# Altium schematic sheet Multiboard_Analog_Connector.SchDoc
size A3; SheetNumber: 1; SheetTotal: 4
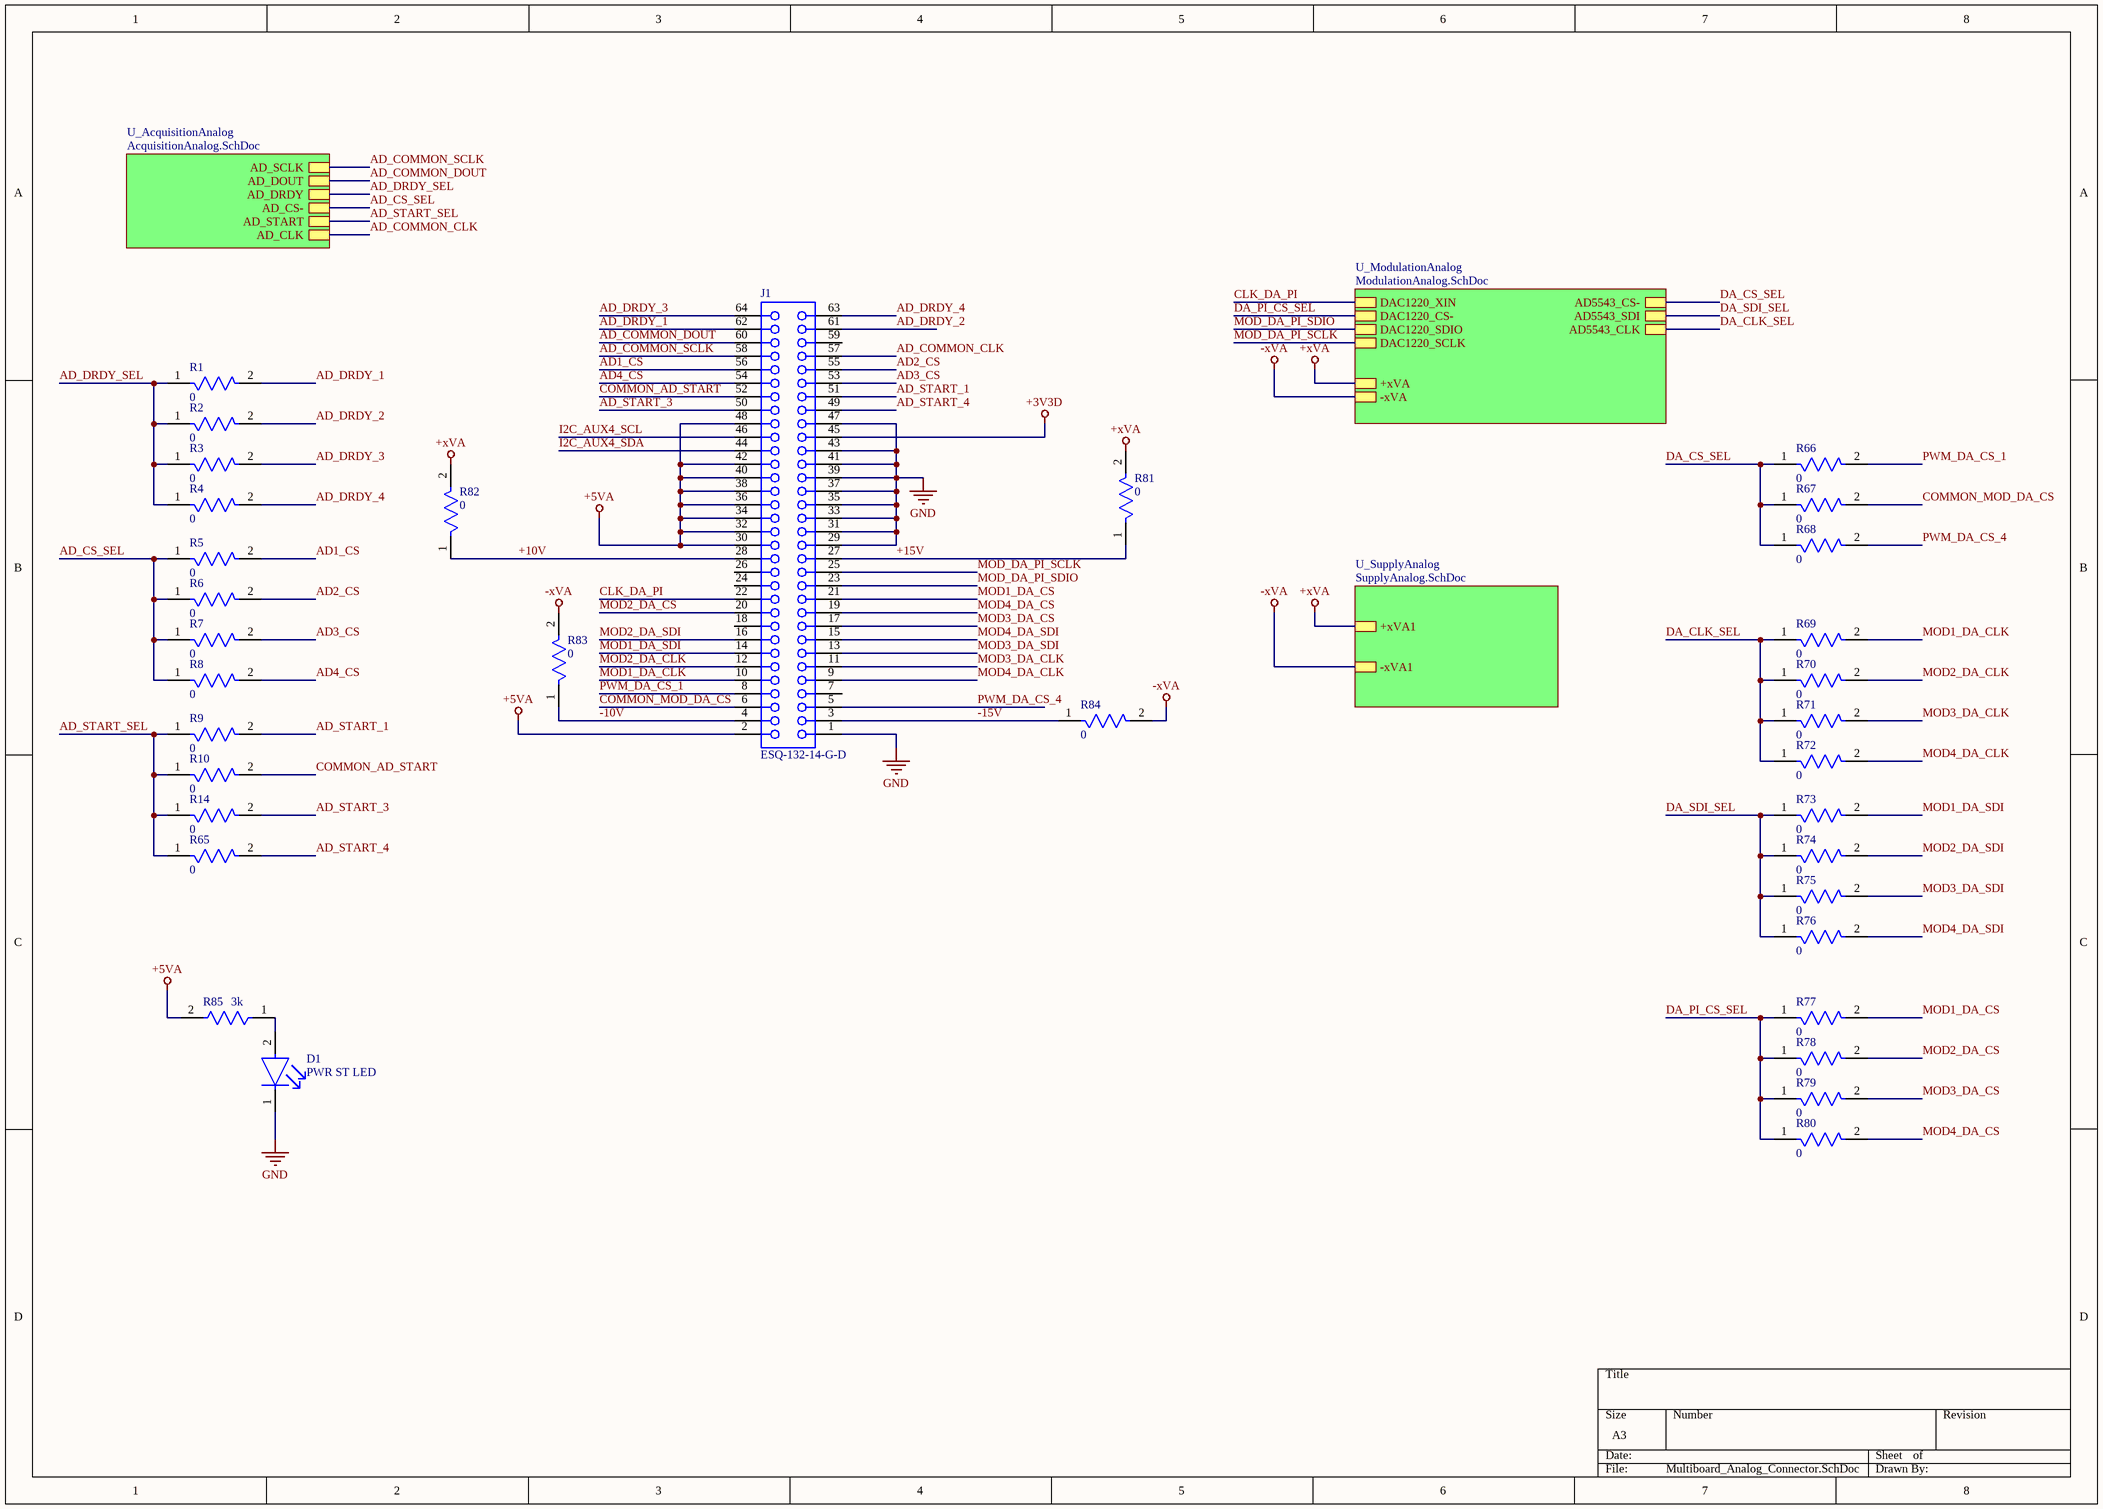
[diagram p0: Multiboard_Analog_Connector.SchDoc]

## Parts
D1  PWR ST LED  [FP-APHCM2012SYCK-F01-MFG]
J1  ESQ-132-14-G-D  [SMTC-ESQ-132-14-X-D]
R1  0  [FP-RR1220-MFG]
R2  0  [FP-RR1220-MFG]
R3  0  [FP-RR1220-MFG]
R4  0  [FP-RR1220-MFG]
R5  0  [FP-RR1220-MFG]
R6  0  [FP-RR1220-MFG]
R7  0  [FP-RR1220-MFG]
R8  0  [FP-RR1220-MFG]
R9  0  [FP-RR1220-MFG]
R10  0  [FP-RR1220-MFG]
R14  0  [FP-RR1220-MFG]
R65  0  [FP-RR1220-MFG]
R66  0  [FP-RR1220-MFG]
R67  0  [FP-RR1220-MFG]
R68  0  [FP-RR1220-MFG]
R69  0  [FP-RR1220-MFG]
R70  0  [FP-RR1220-MFG]
R71  0  [FP-RR1220-MFG]
R72  0  [FP-RR1220-MFG]
R73  0  [FP-RR1220-MFG]
R74  0  [FP-RR1220-MFG]
R75  0  [FP-RR1220-MFG]
R76  0  [FP-RR1220-MFG]
R77  0  [FP-RR1220-MFG]
R78  0  [FP-RR1220-MFG]
R79  0  [FP-RR1220-MFG]
R80  0  [FP-RR1220-MFG]
R81  0  [FP-RR1220-MFG]
R82  0  [FP-RR1220-MFG]
R83  0  [FP-RR1220-MFG]
R84  0  [FP-RR1220-MFG]
R85  3k  [FP-RR1220-MFG]

## Sub-sheets
U_AcquisitionAnalog = AcquisitionAnalog.SchDoc: AD_SCLK, AD_DOUT, AD_DRDY, AD_CS-, AD_START, AD_CLK
U_ModulationAnalog = ModulationAnalog.SchDoc: DAC1220_XIN, DAC1220_CS-, DAC1220_SDIO, DAC1220_SCLK, AD5543_SDI, AD5543_CLK, AD5543_CS-, +xVA, -xVA
U_SupplyAnalog = SupplyAnalog.SchDoc: +xVA1, -xVA1

## Nets
+3V3D: J1.45
+5VA: J1.2 J1.30 J1.32 J1.34 J1.36 J1.38 J1.40 J1.42 J1.48 R85.2
+xVA: R81.2 R82.2 ; sheet U_ModulationAnalog/+xVA, sheet U_SupplyAnalog/+xVA1
-xVA: R83.2 R84.2 ; sheet U_ModulationAnalog/-xVA, sheet U_SupplyAnalog/-xVA1
GND: D1.1(C) J1.1 J1.29 J1.31 J1.33 J1.35 J1.37 J1.39 J1.41 J1.43 J1.47
+10V: J1.28 R82.1
+15V: J1.27 R81.1
-10V: J1.4 R83.1
-15V: J1.3 R84.1
AD1_CS: J1.56 R5.2
AD2_CS: J1.55 R6.2
AD3_CS: J1.53 R7.2
AD4_CS: J1.54 R8.2
AD_COMMON_CLK: J1.57 ; sheet U_AcquisitionAnalog/AD_CLK
AD_COMMON_DOUT: J1.60 ; sheet U_AcquisitionAnalog/AD_DOUT
AD_COMMON_SCLK: J1.58 ; sheet U_AcquisitionAnalog/AD_SCLK
AD_CS_SEL: R5.1 R6.1 R7.1 R8.1 ; sheet U_AcquisitionAnalog/AD_CS-
AD_DRDY_1: J1.62 R1.2
AD_DRDY_2: J1.61 R2.2
AD_DRDY_3: J1.64 R3.2
AD_DRDY_4: J1.63 R4.2
AD_DRDY_SEL: R1.1 R2.1 R3.1 R4.1 ; sheet U_AcquisitionAnalog/AD_DRDY
AD_START_1: J1.51 R9.2
AD_START_3: J1.50 R14.2
AD_START_4: J1.49 R65.2
AD_START_SEL: R9.1 R10.1 R14.1 R65.1 ; sheet U_AcquisitionAnalog/AD_START
CLK_DA_PI: J1.22 ; sheet U_ModulationAnalog/DAC1220_XIN
COMMON_AD_START: J1.52 R10.2
COMMON_MOD_DA_CS: J1.6 R67.2
DA_CLK_SEL: R69.1 R70.1 R71.1 R72.1 ; sheet U_ModulationAnalog/AD5543_CLK
DA_CS_SEL: R66.1 R67.1 R68.1 ; sheet U_ModulationAnalog/AD5543_CS-
DA_PI_CS_SEL: R77.1 R78.1 R79.1 R80.1 ; sheet U_ModulationAnalog/DAC1220_CS-
DA_SDI_SEL: R73.1 R74.1 R75.1 R76.1 ; sheet U_ModulationAnalog/AD5543_SDI
I2C_AUX4_SCL: J1.46
I2C_AUX4_SDA: J1.44
MOD1_DA_CLK: J1.10 R69.2
MOD1_DA_CS: J1.21 R77.2
MOD1_DA_SDI: J1.14 R73.2
MOD2_DA_CLK: J1.12 R70.2
MOD2_DA_CS: J1.20 R78.2
MOD2_DA_SDI: J1.16 R74.2
MOD3_DA_CLK: J1.11 R71.2
MOD3_DA_CS: J1.17 R79.2
MOD3_DA_SDI: J1.13 R75.2
MOD4_DA_CLK: J1.9 R72.2
MOD4_DA_CS: J1.19 R80.2
MOD4_DA_SDI: J1.15 R76.2
MOD_DA_PI_SCLK: J1.25 ; sheet U_ModulationAnalog/DAC1220_SCLK
MOD_DA_PI_SDIO: J1.23 ; sheet U_ModulationAnalog/DAC1220_SDIO
PWM_DA_CS_1: J1.8 R66.2
PWM_DA_CS_4: J1.5 R68.2
NetD1_2: D1.2(A) R85.1

Not connected (* = marked no-connect by the designer): J1 7 18 24 26 59

## Library data of the parts
D1 = CMP-44529-000064-1: LED YELLOW CLEAR CHIP SMD; Number of LEDs: 1; Luminous Intensity: 150mcd; Dominant Wavelength: 590nm; Test Current: 20mA; Illumination Color: Green; Forward Voltage: 2V; Viewing Angle: 110°; Number of Pins: 2; Packaging: Tape and Reel; Width: 1.25mm; Height: 0.4mm; Lens Color: Clear; RoHS Compliant: Yes; Lead Free: Lead Free; Min Operating Temperature: -40°C; Case Code (Imperial): 0805; Case/Package: 0805; Series: APHCM; Wavelength: 590nm; Max Operating Temperature: 85°C; Length: 2mm; Color: Yellow; Package Quantity: 2000; Mount: Surface Mount; Lens Style: Clear; Forward Current: 20mA; Case Code (Metric): 2012
J1 = CMP-1026-00064-1: PC/104(TM) Elevated Socket Strip, Through-hole, Vertical, -55 to 125 degC, 2.54 mm Pitch, 64-Pin, Female, RoHS; Manufacturer: Samtec; Pitch: 2.54 mm; System: Connector; DatasheetVersion: F-214; Mounting Technology: Through-hole; RoHS: True; PackageReference: ESQ-132-14-X-D; PackageVersion: BZ, 9/1998; Orientation: Vertical; ComponentLink3URL: http://www.samtec.com/documents/webfiles/cpdf/ESQ-1XX-XX-X-X-XXX-XX-X-XX-MKT.pdf; ComponentLink1URL: http://www.samtec.com; PartNumber: ESQ-132-14-G-D; ComponentLink2URL: http://www.samtec.com/documents/webfiles/pdf/ESQ_TH.PDF; ComponentLink3Description: Package Specification; ComponentLink1Description: Manufacturer URL; PackageDescription: ESQ Strip ASM; Temperature Range: -55 to 125 degC; ComponentLink2Description: Datasheet
R1-R10 R14 R65-R85 = CMP-2001-03560-2: 49.9Ω ±0.5% 0.1W 1/10W Chip Resistor 0805 (2012 Metric) Thin Film; Voltage Rating: 100V; Temperature Coefficient: 50ppm/°C; Max Power Dissipation: 100mW; Resistance: 49.9R; Packaging: Tape and Reel; Length: 0.079inch; Termination: SMD/SMT; Case Code (Metric): 2012; Voltage Rating (DC): 100V; Height: 0.02inch; Width: 0.049inch; RoHS Compliant: Yes; Tolerance: 0.5%; Case/Package: 0805; Resistance Tolerance: 0.5%; Lead Free: Lead Free; Size Code: 0805; Min Operating Temperature: -55°C; Max Operating Temperature: 125°C; Case Code (Imperial): 0805; Package Quantity: 1; Resistor Type: Thin Film; Number of Terminations: 2; Power Rating: 100mW; Series: RR